# EAGLE design moscow_esp8266_reva (EAGLE 6.6.0)

## Sheet 1 of 2
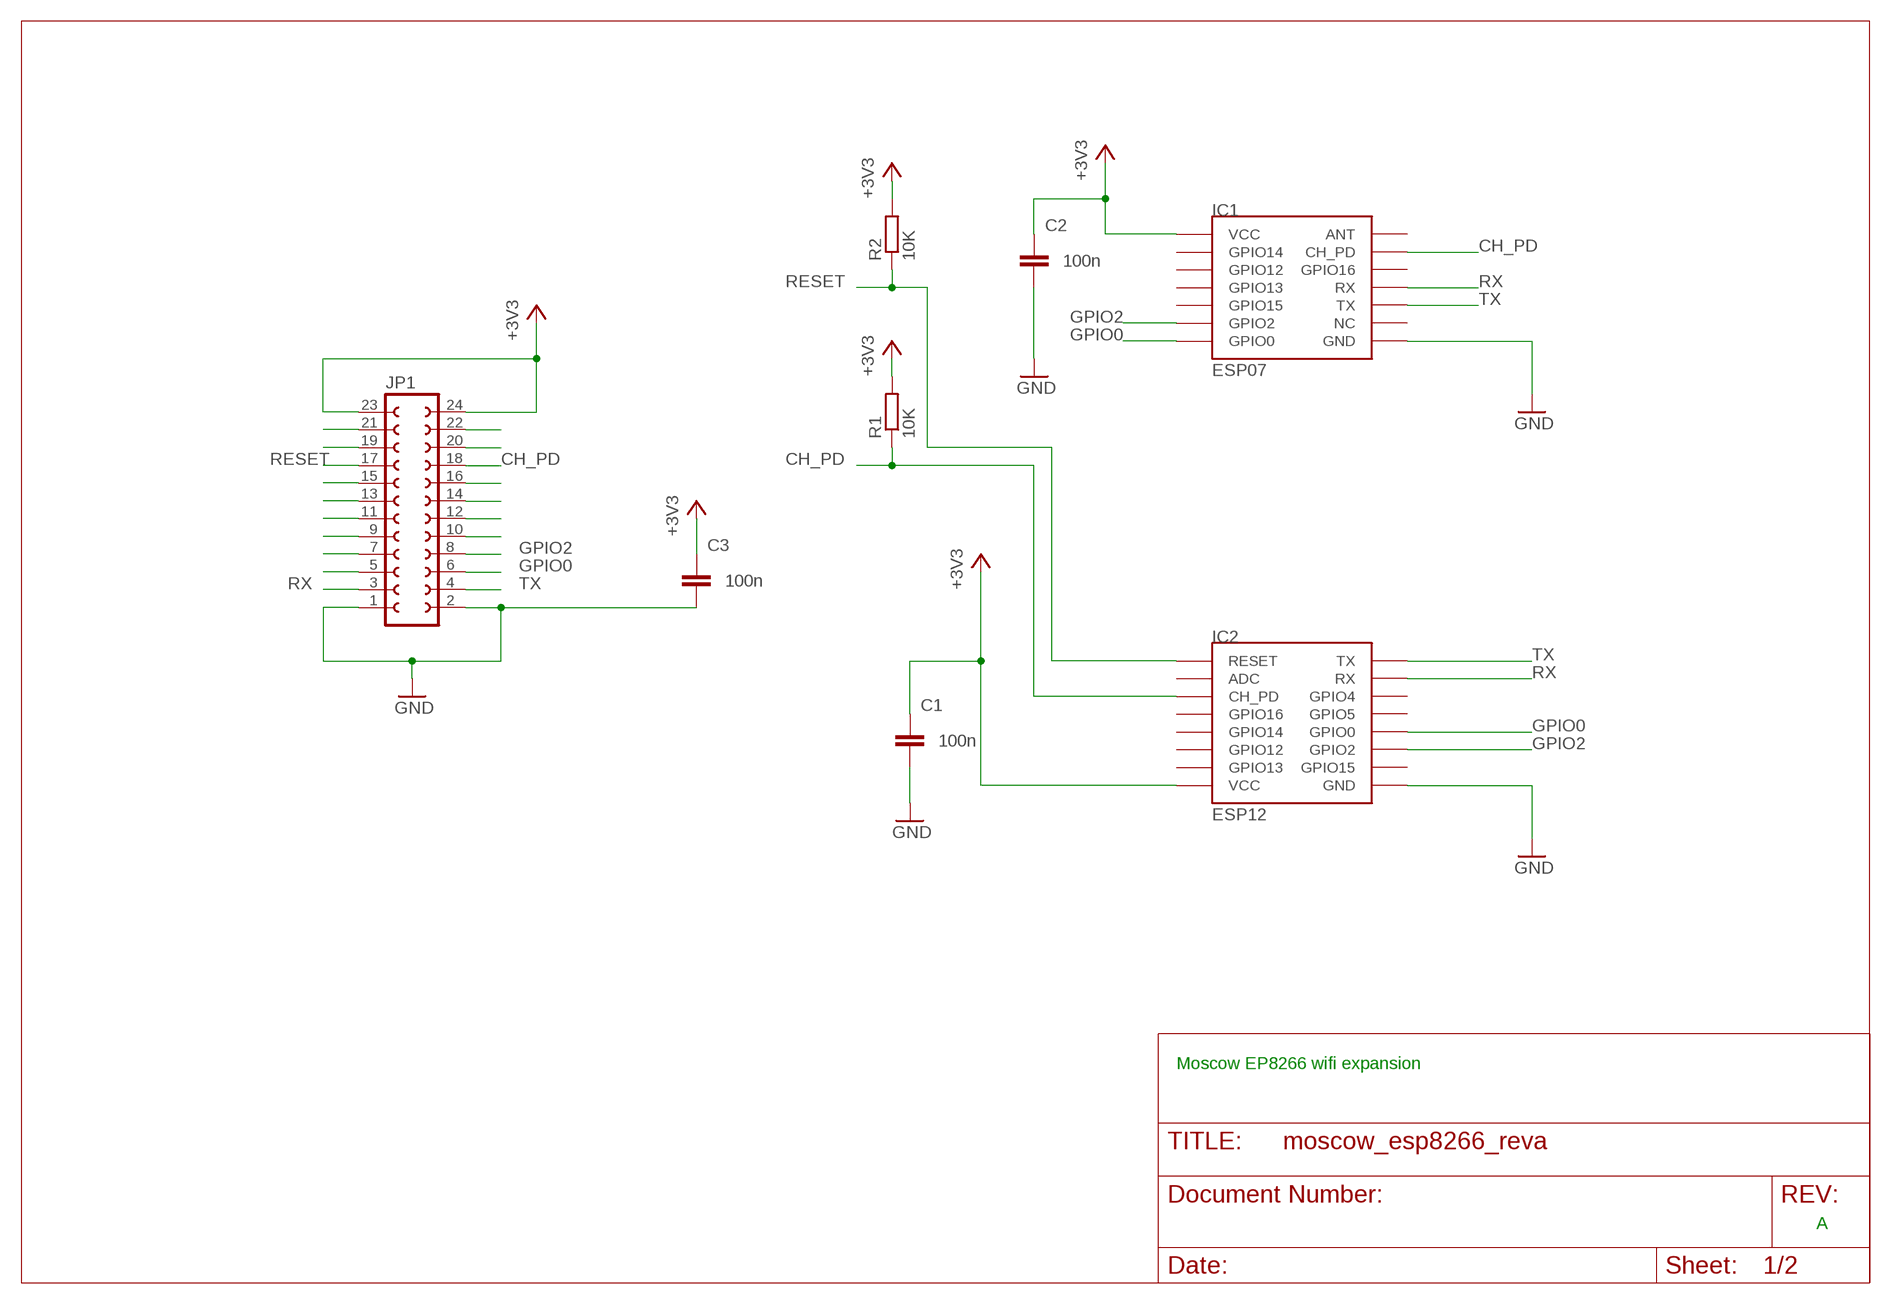
[diagram p0: schematic, sheet 1]

### Parts
C1  100n  C-EUC0805  [C0805]
C2  100n  C-EUC0805  [C0805]
C3  100n  C-EUC0805  [C0805]
IC1  ESP07  [ESP07]
IC2  ESP12  [ESP12]
JP1  FE12-2  [FE12-2]
R1  10K  R-EU_R0805  [R0805]
R2  10K  R-EU_R0805  [R0805]

### Nets
+3V3: C1.1 C2.1 C3.1 IC1.VCC IC2.VCC JP1.23 JP1.24 R1.2 R2.2
CH_PD: IC1.CH_PD IC2.CH_PD JP1.18 R1.1
GND: C1.2 C2.2 C3.2 IC1.GND IC2.GND JP1.1 JP1.2
GPIO0: IC1.GPIO0 IC2.GPIO0 JP1.6
GPIO2: IC1.GPIO2 IC2.GPIO2 JP1.8
N$5: JP1.14
N$9: JP1.22
N$10: JP1.20
N$11: JP1.7
N$12: JP1.16
N$13: JP1.5
N$14: JP1.12
N$15: JP1.10
N$21: JP1.21
N$22: JP1.19
N$24: JP1.15
N$25: JP1.13
N$26: JP1.11
N$27: JP1.9
RESET: IC2.RESET JP1.17 R2.1
RX: IC1.RX IC2.RX JP1.3
TX: IC1.TX IC2.TX JP1.4
Unconnected: IC1.ANT IC1.GPIO12 IC1.GPIO13 IC1.GPIO14 IC1.GPIO15 IC1.GPIO16 IC1.NC IC2.ADC IC2.GPIO4 IC2.GPIO5 IC2.GPIO12 IC2.GPIO13 IC2.GPIO14 IC2.GPIO15 IC2.GPIO16

### Notes on the sheet
- Moscow EP8266 wifi expansion
- A

## Sheet 2 of 2
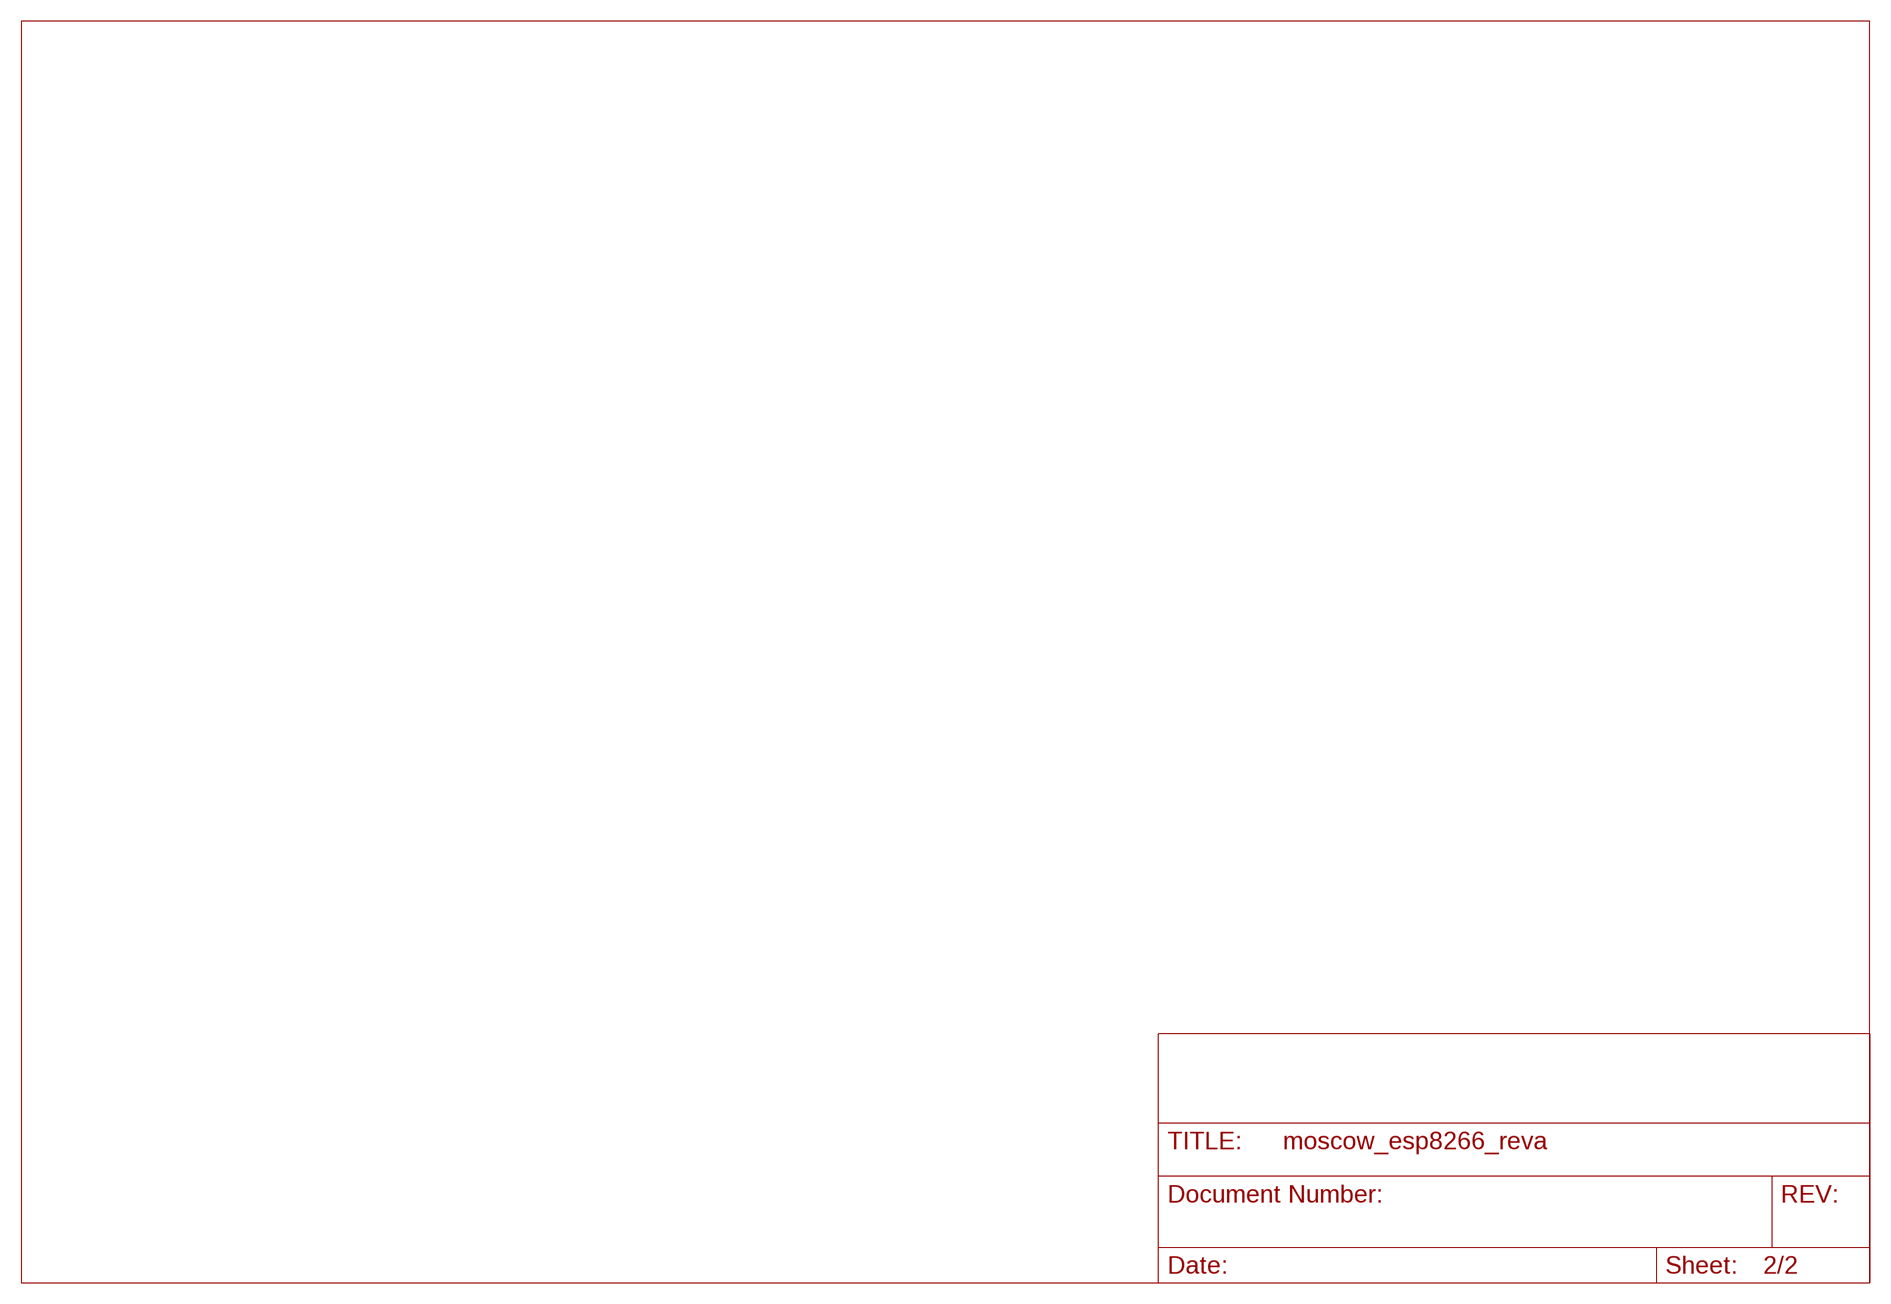
[diagram p1: schematic, sheet 2]

## Library data of the parts
C1-C3 = rcl:C-EU: CAPACITOR, European symbol
IC1 = esp8266modules:ESP07: ESP8266 Wifi module 07 & 08
IC2 = esp8266modules:ESP12: ESP8266 Wifi module 12
JP1 = con-lsta:FE12-2: FEMALE HEADER; OC_FARNELL: unknown; OC_NEWARK: unknown
R1 R2 = rcl:R-EU_: RESISTOR, European symbol

## Board
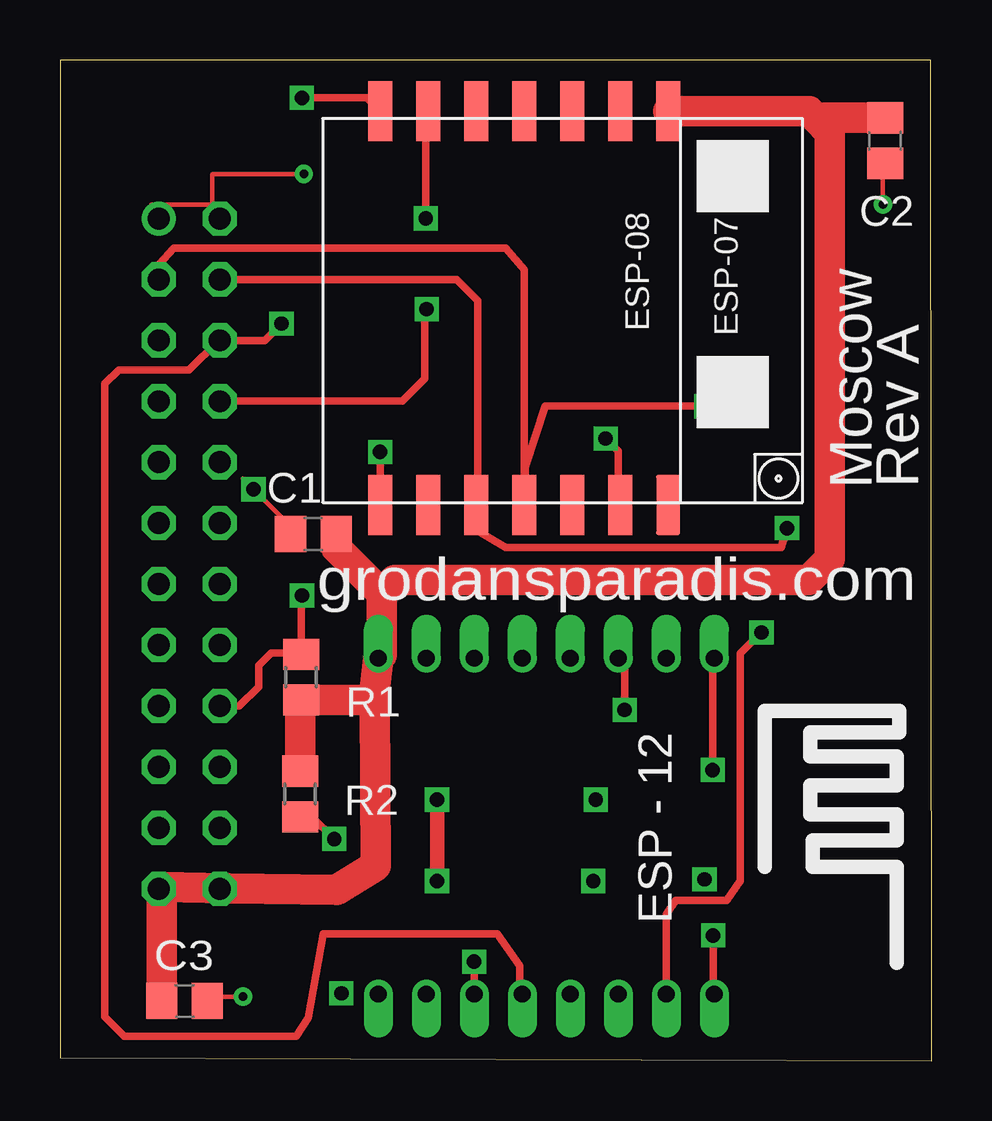
[diagram p2: board, top side]
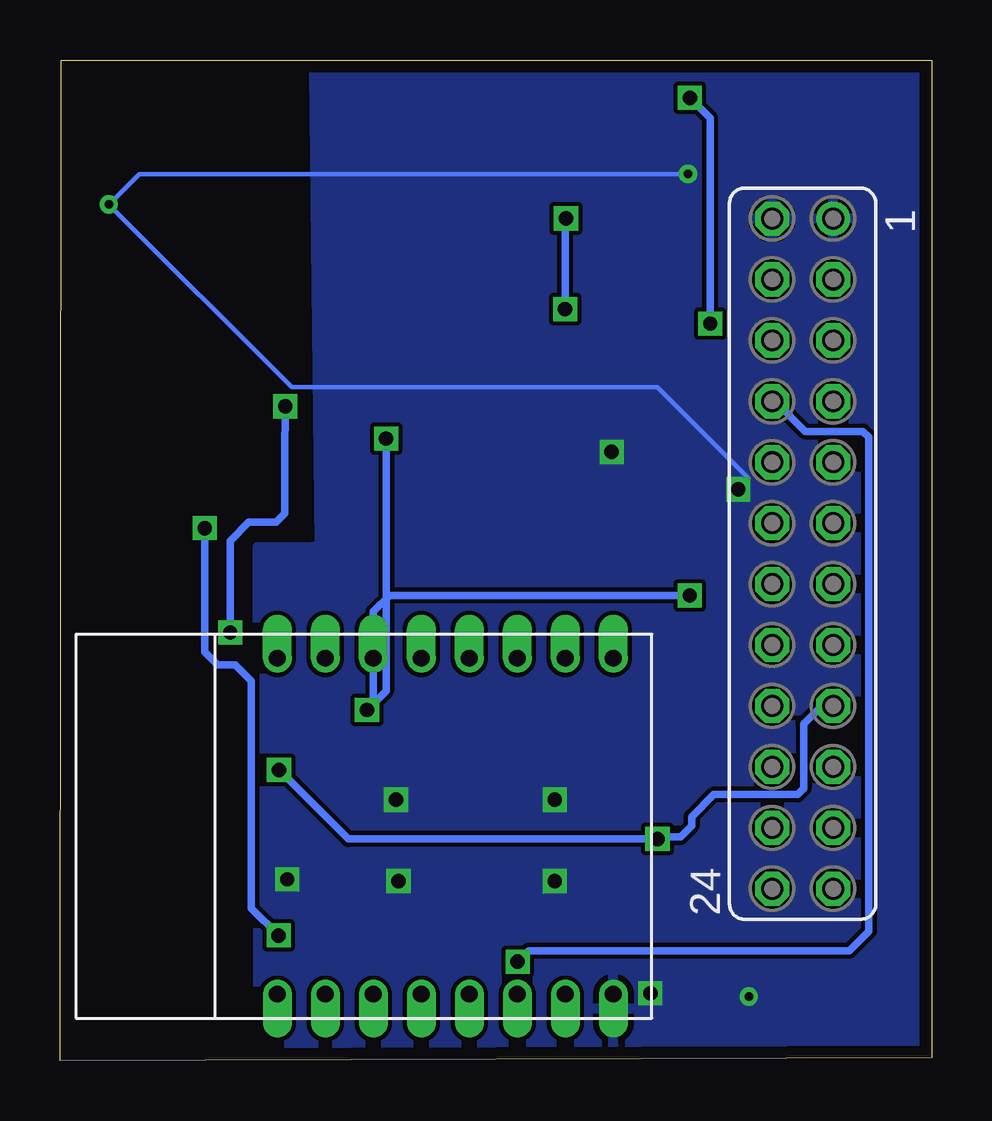
[diagram p3: board, bottom side, seen from below]

Size 36.32 x 41.72 mm. Coordinates in mm from the lower left corner, seen from the top.
Outline: 0,0.13 36.32,0 36.27,41.72 0,41.71 0,0.13
Copper layers (1*16): Top 0.0356mm / dielectric 1.5011mm / Bottom 0.0356mm
Design rules "SilverCircuits": minimum track width 7mil, minimum drill 14mil, track to track 7mil, track to pad 7mil, pad to pad 7mil, via to via 7mil, smd to smd 0mil, copper to edge 20mil, drill to drill 8mil, minimum pad ring 10mil, minimum via ring 8mil, stop-mask expansion 4mil, vias tented up to drill 0mil, thermal gap 10mil

### Footprints (pad centres in the part's own frame; a part is rotated, then mirrored left to right if it is on the bottom)
C0805 = smd 1.3 x 1.5: 1 -0.95,0; 2 0.95,0
ESP07 = smd 2.5 x 1: ANT 8.2,6.8; CH_PD 8.2,4.8; GND 8.2,-5.2; GPIO0 -8.2,-5.2; GPIO2 -8.2,-3.2; GPIO12 -8.2,2.8; GPIO13 -8.2,0.8; GPIO14 -8.2,4.8; GPIO15 -8.2,-1.2; GPIO16 8.2,2.8; NC 8.2,-3.2; RX 8.2,0.8; TX 8.2,-1.2; VCC -8.2,6.8
ESP12 = drill 0.7 offset: ADC -7.1,3.8; CH_PD -7.1,1.8; GND 6.9,-8.2; GPIO0 6.9,-2.2; GPIO2 6.9,-4.2; GPIO4 6.9,1.8; GPIO5 6.9,-0.2; GPIO12 -7.1,-4.2; GPIO13 -7.1,-6.2; GPIO14 -7.1,-2.2; GPIO15 6.9,-6.2; GPIO16 -7.1,-0.2; RESET -7.1,5.8; RX 6.9,3.8; TX 6.9,5.8; VCC -7.1,-8.2
FE12-2 = drill 0.914: 1 -13.97,1.27 | drill 0.914 octagon: 2 -13.97,-1.27; 3 -11.43,1.27; 4 -11.43,-1.27; 5 -8.89,1.27; 6 -8.89,-1.27; 7 -6.35,1.27; 8 -6.35,-1.27; 9 -3.81,1.27; 10 -3.81,-1.27; 11 -1.27,1.27; 12 -1.27,-1.27; 13 1.27,1.27; 14 1.27,-1.27; 15 3.81,1.27; 16 3.81,-1.27; 17 6.35,1.27; 18 6.35,-1.27; 19 8.89,1.27; 20 8.89,-1.27; 21 11.43,1.27; 22 11.43,-1.27; 23 13.97,1.27; 24 13.97,-1.27
R0805 = smd 1.3 x 1.5: 1 -0.95,0; 2 0.95,0

### Placement (x,y rotation side)
C1  10.56,21.95 180 top
C2  34.38,38.35 270 top
C3  5.19,2.49 0 top
IC1  18.54,31.37 270 top
IC2  21.46,9.68 270 top
JP1  5.38,21.14 270 bottom
R1  10.04,15.99 270 top
R2  10,11.12 90 top

### Tracks (layer width: path | path; a pad name or v marks a point on that pad's centre or on a via)
+3V3
  Top 0.406: 4.24,7.17 JP1.23
  Top 1.27: C3.1 4.24,7.17 | 6.99,7.18 4.2,7.25 JP1.23 | 6.99,7.18 JP1.24 | 6.99,7.18 11.52,7.11 13.16,8.12 13.12,14.93 | 13.12,14.93 13.12,15.48 13.29,16.9 13.36,16.87 IC2.VCC 13.4,16.92 13.4,19.48 | IC1.VCC 31.21,39.57 31.48,39.3 | 31.48,39.3 32.08,38.71 32.08,20.91 31.19,20.03 13.95,20.03 13.4,19.48 | C1.1 11.51,21.38 13.4,19.48 | C2.1 31.48,39.3 | R2.2 10,15 R1.2 13.02,15.04 13.12,14.93
CH_PD  (via drill 0.6)
  Top 0.305: IC1.CH_PD 23.27,23.1 23.27,25.4 v22.73,25.94 | v10.08,19.39 10.04,19.35 R1.1 9.98,17 8.8,17 8.27,16.47 8.27,15.59 7.47,14.79 JP1.18 | v23.53,14.62 23.53,16.52 IC2.CH_PD
  Bottom 0.305: v10.08,19.39 22.59,19.39 23.27,18.72 23.27,14.89 v23.53,14.62 22.73,15.42 v22.73,25.94
GND  (via drill 0.36, 0.6)
  Top 0.178: v8.06,23.82 7.62,24.26 10.16,21.72 C1.2 | v34.29,35.69 34.29,36.96 C2.2 | 6.35,35.69 3.81,35.69 JP1.1 | v10.16,36.96 6.35,36.96 6.35,35.69 | 6.35,35.69 JP1.2 | v7.62,2.67 6.35,2.67 C3.2
  Top 0.305: v13.34,25.38 IC1.GND
  Top 0.61: v15.71,10.88 v15.71,7.49
  Bottom 0.178: v10.16,36.96 33.02,36.96 v34.29,35.69 26.67,28.07 11.43,28.07 7.62,24.26 v8.06,23.82
  other vias: 11.72,2.81 22.22,7.49 26.85,7.56 22.32,10.88
  pour Bottom: 0.28,41.42 0.25,41.42 0.25,0.21 24.44,0.51 28.06,0.56 28.09,21.42 25.8,21.42 25.49,21.51 25.73,41.26 0.51,41.5 0.51,41.08
GPIO0  (via drill 0.6)
  Top 0.305: v9.23,30.73 8.53,30.03 JP1.6 6.62,30.03 5.38,28.78 2.44,28.78 1.87,28.22 1.87,1.83 2.69,1.01 9.84,1.01 10.35,1.79 10.96,5.3 12.62,5.29 18.21,5.29 19.16,3.95 19.16,2.88 IC2.GPIO0 | v10.08,40.14 12.77,40.14 IC1.GPIO0
  Bottom 0.305: v9.23,30.73 9.23,39.29 v10.08,40.14
GPIO2  (via drill 0.6)
  Top 0.305: JP1.8 14.26,27.49 15.2,28.43 15.2,31.26 v15.28,31.33 | v15.24,35.11 15.24,39.47 IC1.GPIO2 | v17.25,4.13 IC2.GPIO2
  Bottom 0.305: v15.28,31.33 15.28,35.08 v15.24,35.11 | JP1.8 6.52,27.49 5.27,26.23 2.86,26.23 2.62,25.99 2.62,5.4 3.43,4.59 16.8,4.59 v17.25,4.13
RESET  (via drill 0.6)
  Top 0.305: R2.1 10.5,10.17 v11.43,9.24 | v27.19,12.12 27.19,16.71 IC2.RESET
  Bottom 0.305: v27.19,12.12 24.32,9.24 v11.43,9.24 11.34,9.33 10.47,9.33 10,9.79 R2.1 9.08,11.1 5.59,11.1 5.34,11.34 5.34,14.03 4.58,14.79 JP1.17
RX  (via drill 0.6)
  Top 0.305: IC2.RX 25.27,6.09 25.66,6.68 27.78,6.68 28.34,7.51 28.34,16.97 v29.23,17.85 | v26.93,27.28 20.21,27.28 19.39,24.75 19.39,23.22 IC1.RX 19.34,32.97 18.58,33.87 4.74,33.87 4.14,33.2 4.14,32.6 JP1.3
  Bottom 0.305: v29.23,17.85 29.23,21.67 28.45,22.45 27.32,22.45 26.96,22.8 26.96,25.17 v26.93,27.28
TX  (via drill 0.6)
  Top 0.305: JP1.4 16.52,32.57 17.41,31.68 17.41,23.24 IC1.TX 17.34,22.13 18.58,21.39 30.04,21.39 v30.29,22.2 | v27.21,5.22 27.21,2.83 IC2.TX
  Bottom 0.305: v30.29,22.2 30.29,17.04 29.76,16.51 29.02,16.51 28.34,15.84 28.34,6.36 v27.21,5.22

### Text on the board
tNames: Moscow | Rev A | grodansparadis.com